# EAGLE design PCF8574 (EAGLE 7.6.0)
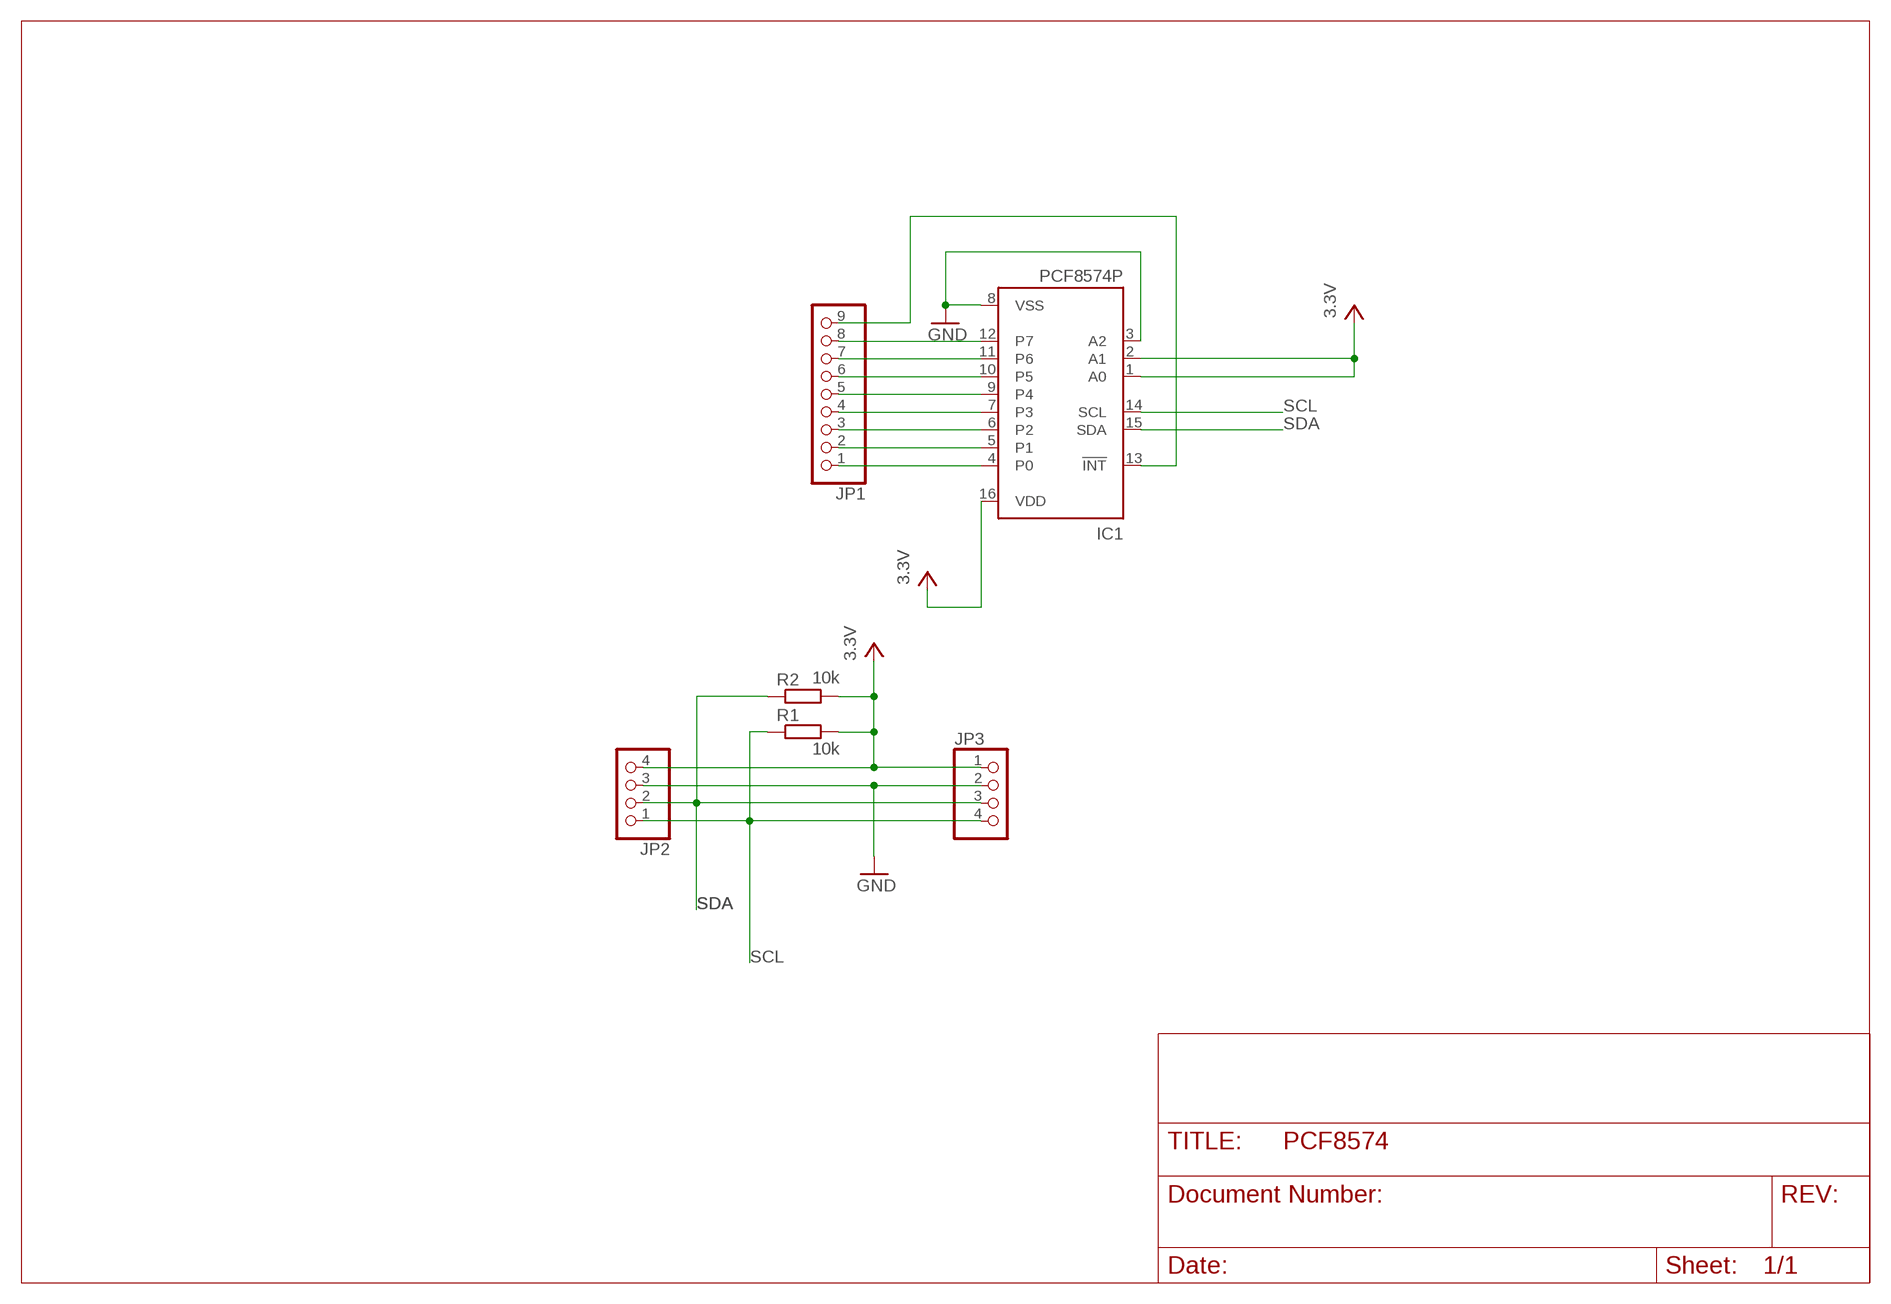
[diagram p0: schematic, sheet 1]

## Parts
IC1  PCF8574P  [DIL16]
JP1  PINHD-1X9  [1X09]
JP2  PINHD-1X4/90  [1X04/90]
JP3  PINHD-1X4/90  [1X04/90]
R1  10k  R-EU_0309/12  [0309/12]
R2  10k  R-EU_0309/12  [0309/12]

## Nets
GND: IC1.3(A2) IC1.8(VSS) JP2.3 JP3.2
N$1: IC1.4(P0) JP1.1
N$2: IC1.5(P1) JP1.2
N$3: IC1.6(P2) JP1.3
N$4: IC1.7(P3) JP1.4
N$5: IC1.9(P4) JP1.5
N$6: IC1.10(P5) JP1.6
N$7: IC1.11(P6) JP1.7
N$8: IC1.12(P7) JP1.8
N$9: IC1.13(!INT) JP1.9
SCL: IC1.14(SCL) JP2.1 JP3.4 R1.1
SDA: IC1.15(SDA) JP2.2 JP3.3 R2.1
VCC: IC1.1(A0) IC1.2(A1) IC1.16(VDD) JP2.4 JP3.1 R1.2 R2.2 ; supply symbol labelled 3.3V

## Library data of the parts
IC1 = micro-philips:PCF8574: I2C-Bus Remote 8-bit I/O expander http://www.semiconductors.philips.com/acrobat_download/datasheets/PCF8574_4.pdf; MPN: PCF8574PN; OC_FARNELL: 204020; OC_NEWARK: 11N8515
JP1 = pinhead:PINHD-1X9: PIN HEADER
JP2 JP3 = pinhead:PINHD-1X4: PIN HEADER
R1 R2 = rcl-2:R-EU_: RESISTOR, European symbol

## Net classes
0 default: clearance 0.105 mm

## Board
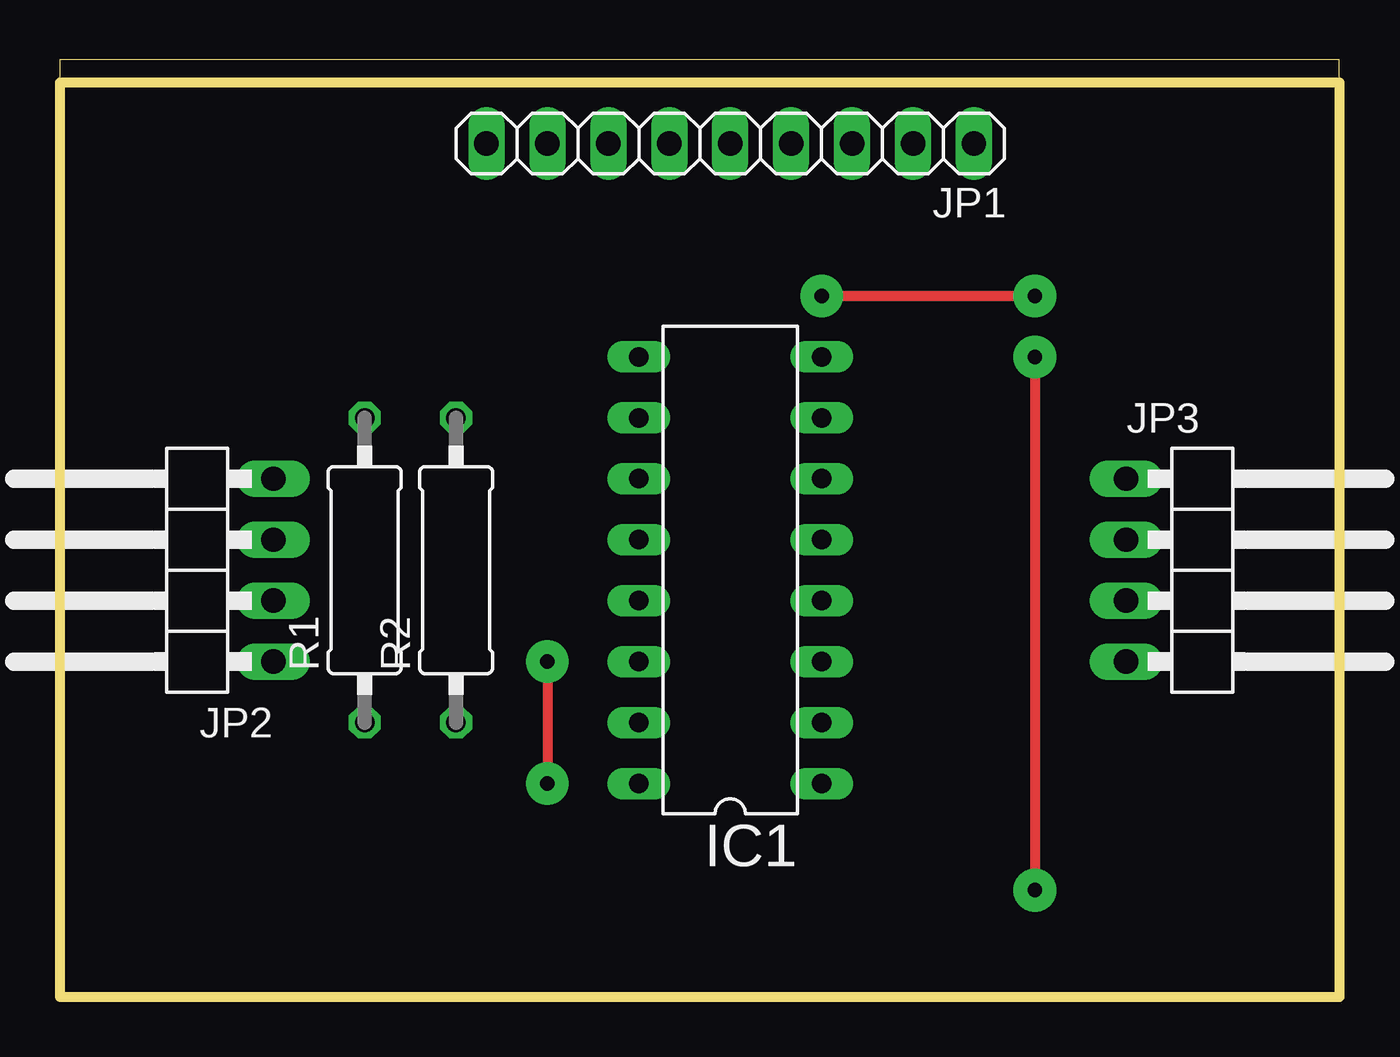
[diagram p1: board, top side]
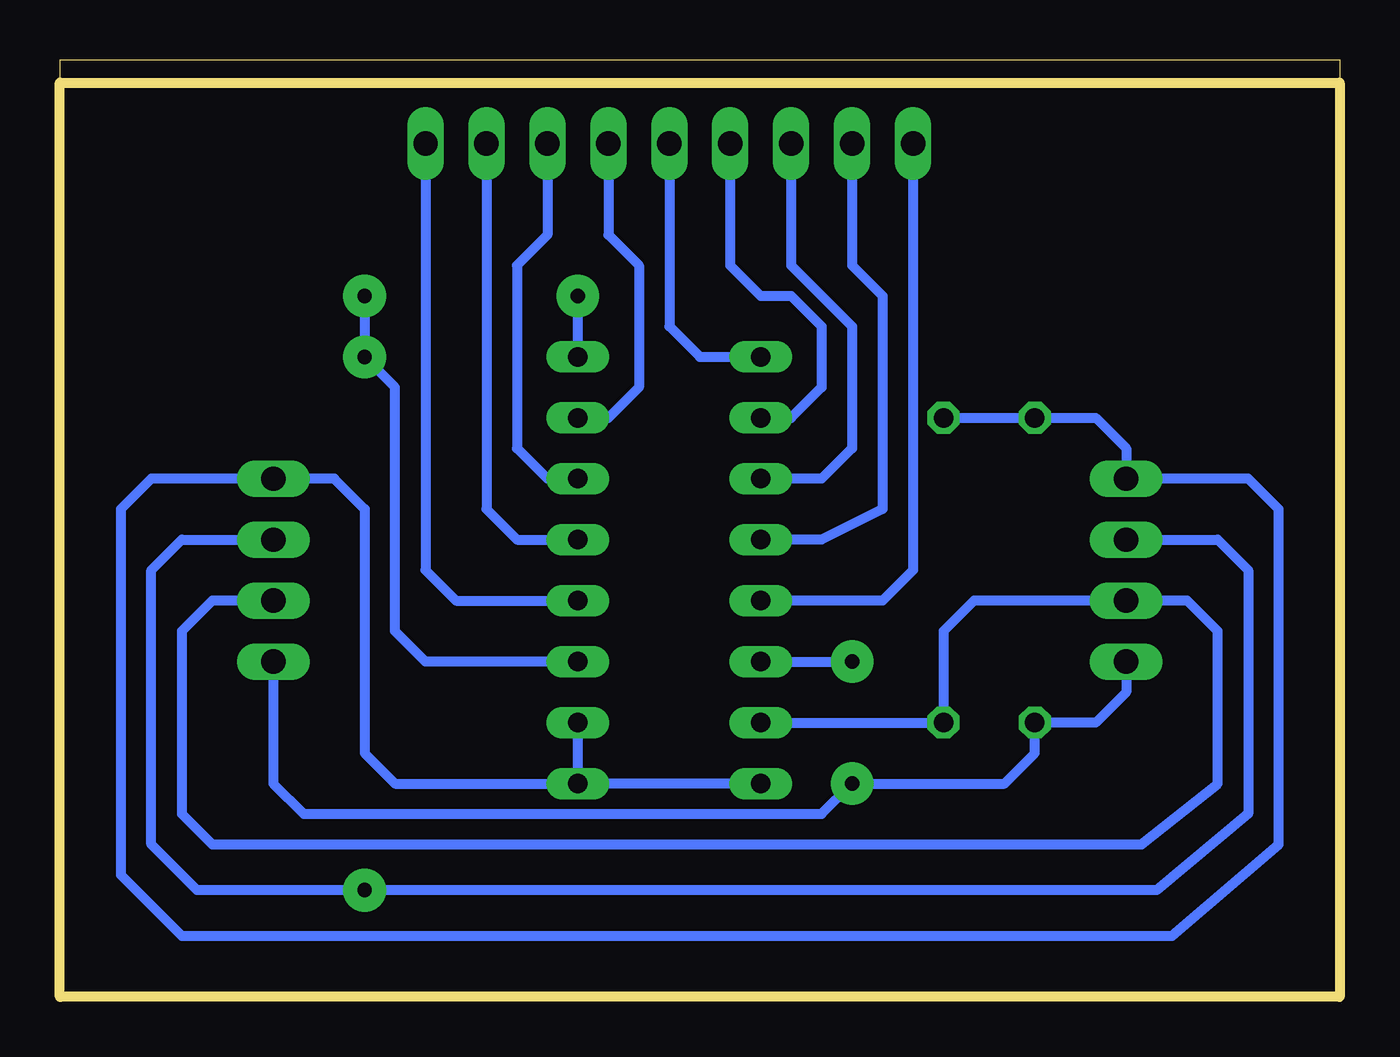
[diagram p2: board, bottom side, seen from below]

Size 53.34 x 39.04 mm. Coordinates in mm from the lower left corner, seen from the top.
Outline: 53.32,0 53.32,39.04 0,39.04 0,38.1
Outline: 53.32,0 0,0 0,38.1
Outline: 53.32,0 53.34,0 53.34,38.1 0,38.1
Copper layers (1*16): Top 0.035mm / dielectric 1.5mm / Bottom 0.035mm
Design rules "PCF8574": minimum track width 10mil, minimum drill 24mil, track to track 0.205mm, track to pad 0.205mm, pad to pad 0.205mm, via to via 0.205mm, smd to smd 8mil, copper to edge 40mil, drill to drill 8mil, minimum pad ring 10mil, minimum via ring 8mil, stop-mask expansion 4mil, vias tented up to drill 0mil, thermal gap 10mil

### Footprints (pad centres in the part's own frame; a part is rotated, then mirrored left to right if it is on the bottom)
DIL16 = drill 0.813 long: 1 -8.89,-3.81; 2 -6.35,-3.81; 3 -3.81,-3.81; 4 -1.27,-3.81; 5 1.27,-3.81; 6 3.81,-3.81; 7 6.35,-3.81; 8 8.89,-3.81; 9 8.89,3.81; 10 6.35,3.81; 11 3.81,3.81; 12 1.27,3.81; 13 -1.27,3.81; 14 -3.81,3.81; 15 -6.35,3.81; 16 -8.89,3.81
1X09 = drill 1.016 long: 1 -10.16,0; 2 -7.62,0; 3 -5.08,0; 4 -2.54,0; 5 0,0; 6 2.54,0; 7 5.08,0; 8 7.62,0; 9 10.16,0
1X04/90 = drill 1.016 long: 1 -3.81,-3.81; 2 -1.27,-3.81; 3 1.27,-3.81; 4 3.81,-3.81
0309/12 = drill 0.813 octagon: 1 -6.35,0; 2 6.35,0

### Placement (x,y rotation side)
IC1  27.94,17.78 90 top
JP1  27.94,35.56 180 top
JP2  5.08,17.78 90 top
JP3  48.26,17.78 270 top
R1  12.7,17.78 90 top
R2  16.51,17.78 90 top

### Tracks (layer width: path | path; a pad name or v marks a point on that pad's centre or on a via)
GND  (via drill 0.6, 0.6 pad 1.78)
  Top 0.406: v31.75,29.21 v40.64,29.21 | v40.64,26.67 v40.64,4.45
  Bottom 0.406: JP2.3 5.08,19.05 3.81,17.78 3.81,7.62 7.62,4.45 v40.64,4.45 47.62,4.45 49.53,6.35 49.53,17.78 48.26,19.05 JP3.2 | IC1.8 v31.75,29.21 | v40.64,29.21 v40.64,26.67 39.37,25.4 39.37,15.24 38.1,13.97 IC1.3
N$1
  Bottom 0.406: JP1.1 38.1,17.78 36.83,16.51 IC1.4
N$2
  Bottom 0.406: JP1.2 35.56,20.32 34.29,19.05 IC1.5
N$3
  Bottom 0.406: JP1.3 33.02,31.75 34.29,30.48 34.29,22.86 33.02,21.59 IC1.6
N$4
  Bottom 0.406: JP1.4 30.48,31.75 29.21,30.48 29.21,25.4 30.48,24.13 IC1.7
N$5
  Bottom 0.406: JP1.5 27.94,27.94 26.67,26.67 IC1.9
N$6
  Bottom 0.406: JP1.6 25.4,30.48 24.13,29.21 22.86,29.21 21.59,27.94 21.59,25.4 22.86,24.13 IC1.10
N$7
  Bottom 0.406: JP1.7 22.86,30.48 20.32,27.94 20.32,22.86 21.59,21.59 IC1.11
N$8
  Bottom 0.406: JP1.8 20.32,30.48 19.05,29.21 19.05,20.32 21.59,19.05 IC1.12
N$9
  Bottom 0.406: JP1.9 17.78,17.78 19.05,16.51 IC1.13
SCL  (via drill 0.6, 0.6 pad 1.78)
  Top 0.406: v20.32,13.97 v20.32,8.89
  Bottom 0.406: JP2.1 8.89,12.7 10.16,11.43 R1.1 12.7,10.16 13.97,8.89 v20.32,8.89 21.59,7.62 43.18,7.62 44.45,8.89 JP3.4 | IC1.14 v20.32,13.97
SDA
  Bottom 0.406: IC1.15 R2.1 16.51,15.24 15.24,16.51 JP2.2 6.35,16.51 5.08,15.24 5.08,8.89 8.26,6.35 46.99,6.35 48.26,7.62 48.26,15.24 46.99,16.51 JP3.3
VCC
  Bottom 0.406: R2.2 R1.2 10.16,24.13 8.89,22.86 JP2.4 3.81,21.59 2.54,20.32 2.54,6.35 6.99,2.54 48.26,2.54 50.8,5.08 50.8,20.32 49.53,21.59 JP3.1 41.91,21.59 40.64,20.32 40.64,10.16 39.37,8.89 IC1.1 | IC1.16 IC1.1 | IC1.1 IC1.2